# EAGLE design PCB-ETHMG-BOS2_v05-16 (EAGLE 7.5.0)
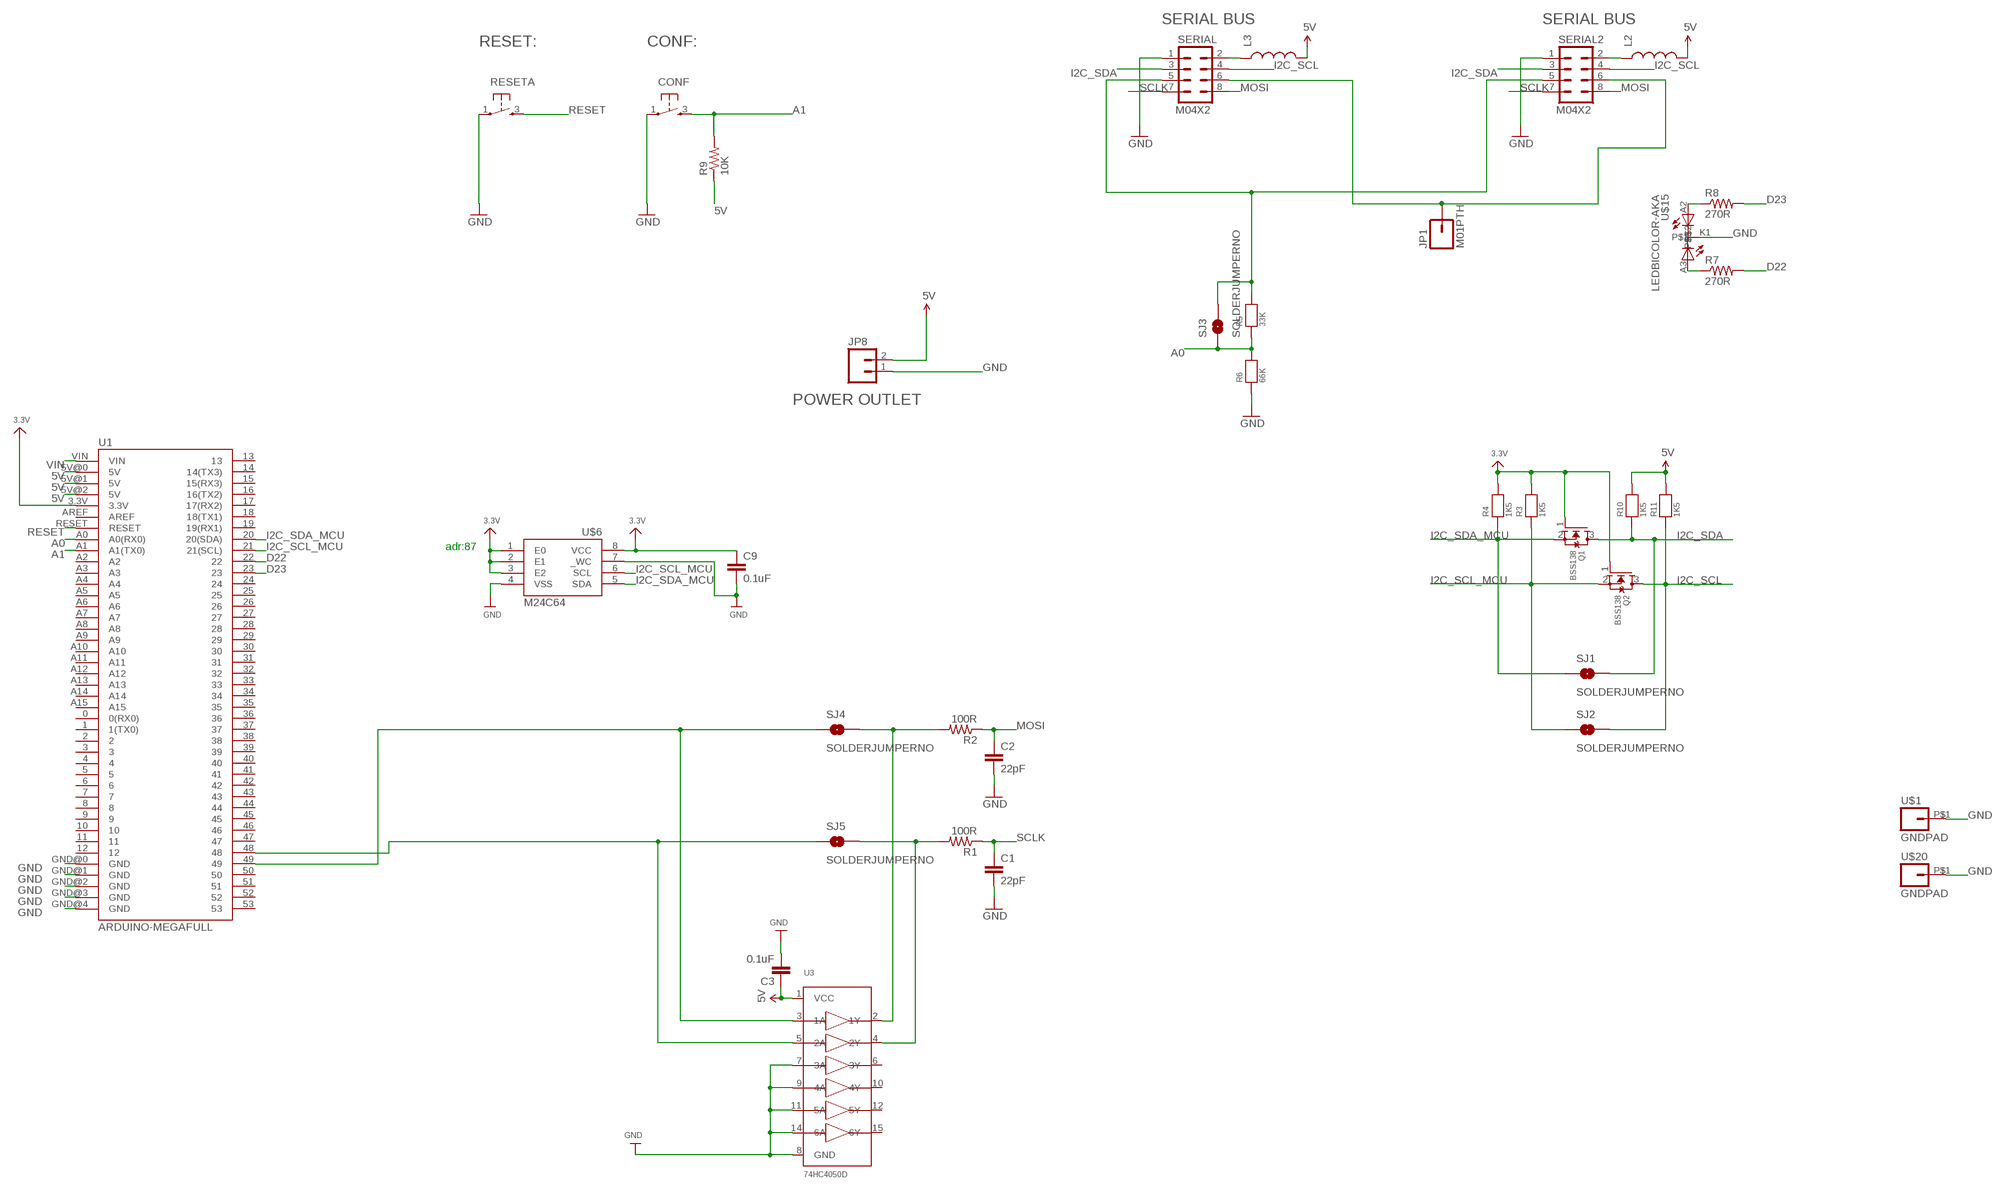
[diagram p0: schematic, sheet 1]

## Parts
C1  22pF  CAP0603-CAP  [0603-CAP]
C2  22pF  CAP0603-CAP  [0603-CAP]
C3  0.1uF  CAP0603-CAP  [0603-CAP]
C9  0.1uF  CAP0603-CAP  [0603-CAP]
CONF  TAC_SWITCH  [PUSHBUTTON]
JP1  M01PTH  [1X01]
JP8  M02PTH4  [1X02_XTRA_BIG]
L2  INDUCTOR0805  [0805]
L3  INDUCTOR0805  [0805]
Q1  BSS138  MOSFET-NREFLOW  [SOT23-R]
Q2  BSS138  MOSFET-NREFLOW  [SOT23-R]
R1  100R  RESISTOR0603-RES  [0603-RES]
R2  100R  RESISTOR0603-RES  [0603-RES]
R3  1K5  RESISTOR0603  [0603]
R4  1K5  RESISTOR0603  [0603]
R5  33K  RESISTOR0603  [0603]
R6  66K  RESISTOR0603  [0603]
R7  270R  RESISTOR0603-RES  [0603-RES]
R8  270R  RESISTOR0603-RES  [0603-RES]
R9  10K  RESISTOR0603-RES  [0603-RES]
R10  1K5  RESISTOR0603  [0603]
R11  1K5  RESISTOR0603  [0603]
RESETA  TAC_SWITCH  [PUSHBUTTON]
SERIAL  M04X2  [2X4]
SERIAL2  M04X2  [2X4]
SJ1  SOLDERJUMPERNO  [SJ_2S-NO]
SJ2  SOLDERJUMPERNO  [SJ_2S-NO]
SJ3  SOLDERJUMPERNO  [SJ_2S-NO]
SJ4  SOLDERJUMPERNO  [SJ_2S-NO]
SJ5  SOLDERJUMPERNO  [SJ_2S-NO]
U1  ARDUINO-MEGAFULL  [ARDUINO_MEGA]
U3  74HC4050D  74HC4050DTSSOP16  [TSSOP16]
U$1  GNDPAD  [3.2MMPAD]
U$6  M24C64  [TSSOP8]
U$15  LEDBICOLOR-AKA  [LED5MM-BICOLOR]
U$20  GNDPAD  [3.2MMPAD]

## Nets
3.3V [Power]: C9.1 Q1.1(G) Q2.1(G) R3.2 R4.2 U1.3.3V U$6.1(E0) U$6.2(E1) U$6.3(E2) U$6.8(VCC)
5V [Power]: C3.1 JP8.2 L2.2 L3.2 R9.1 R10.2 R11.2 U1.5V@0(5V) U1.5V@1(5V) U1.5V@2(5V) U3.1(VCC)
A0: R5.1 R6.2 SJ3.1 U1.A0(A0(RX0))
A1: CONF.3 R9.2 U1.A1(A1(TX0))
D22: R7.2 U1.22
D23: R8.2 U1.23
GND [Power]: C1.2 C2.2 C3.2 C9.2 CONF.1 JP8.1 R6.1 RESETA.1 SERIAL2.1 SERIAL.1 U1.GND@0(GND) U1.GND@1(GND) U1.GND@2(GND) U1.GND@3(GND) U1.GND@4(GND) U3.7(3A) U3.8(GND) U3.9(4A) U3.11(5A) U3.14(6A) U$1.P$1 U$6.4(VSS) U$6.7(_WC) U$15.K1 U$20.P$1
I2C_SCL: Q2.3(D) R11.1 SERIAL2.4 SERIAL.4 SJ2.2
I2C_SCL_MCU: Q2.2(S) R3.1 SJ2.1 U1.21(21(SCL)) U$6.6(SCL)
I2C_SDA: Q1.3(D) R10.1 SERIAL2.3 SERIAL.3 SJ1.2
I2C_SDA_MCU: Q1.2(S) R4.1 SJ1.1 U1.20(20(SDA)) U$6.5(SDA)
MOSI: C2.1 R2.1 SERIAL2.8 SERIAL.8
N$1 [Power]: L2.1 SERIAL2.2
N$2 [Power]: L3.1 SERIAL.2
N$3: R5.2 SERIAL2.5 SERIAL.5 SJ3.2
N$4: R2.2 SJ4.2 U3.2(1Y)
N$5: JP1.1 SERIAL2.6 SERIAL.6
N$6: R1.2 SJ5.2 U3.4(2Y)
N$14: SJ4.1 U1.49 U3.3(1A)
N$15: R8.1 U$15.A2
N$16: R7.1 U$15.A3
RESET: RESETA.3 U1.RESET
SCLK: C1.1 R1.1 SERIAL2.7 SERIAL.7
SCLK_3.3V: SJ5.1 U1.48 U3.5(2A)
VIN [Power]: U1.VIN
Unconnected: U1.0(0(RX0)) U1.1(1(TX0)) U1.2 U1.3 U1.4 U1.5 U1.6 U1.7 U1.8 U1.9 U1.10 U1.11 U1.12 U1.13 U1.14(14(TX3)) U1.15(15(RX3)) U1.16(16(TX2)) U1.17(17(RX2)) U1.18(18(TX1)) U1.19(19(RX1)) U1.24 U1.25 U1.26 U1.27 U1.28 U1.29 U1.30 U1.31 U1.32 U1.33 U1.34 U1.35 U1.36 U1.37 U1.38 U1.39 U1.40 U1.41 U1.42 U1.43 U1.44 U1.45 U1.46 U1.47 U1.50 U1.51 U1.52 U1.53 U1.A2 U1.A3 U1.A4 U1.A5 U1.A6 U1.A7 U1.A8 U1.A9 U1.A10 U1.A11 U1.A12 U1.A13 U1.A14 U1.A15 U1.AREF U3.6(3Y) U3.10(4Y) U3.12(5Y) U3.15(6Y)

## Notes on the sheet
- SERIAL BUS | SERIAL BUS
- RESET: | CONF:
- POWER OUTLET
- adr:87

## Library data of the parts
C1-C3 C9 = SparkFun:CAP: Capacitor Standard 0603 ceramic capacitor, and 0.1" leaded capacitor.
CONF RESETA = SKAARHOJ:TAC_SWITCH: Momentary Switch Button commonly used for reset or general input. Spark Fun Electronics SKU : COM-00097
JP1 = SparkFun:M01: Header 1 Standard 1-pin 0.1" header. Use with straight break away headers (SKU : PRT-00116), right angle break away headers (PRT-00553), swiss pins (PRT-00743), machine pins (PRT-00117), and female headers (PRT-00115).
JP8 = SparkFun:M02: Header 2 Standard 2-pin 0.1" header. Use with straight break away headers (SKU : PRT-00116), right angle break away headers (PRT-00553), swiss pins (PRT-00743), machine pins (PRT-00117), and female headers (PRT-00115). Molex polarized connector foot print use with SKU : PRT-08233 with associated crimp pins and housings.
L2 L3 = SparkFun:INDUCTOR: Inductors Basic Inductor/Choke - 0603 and 1206. Footprints are not proven and vary greatly between part numbers.
Q1 Q2 = microbuilder:MOSFET-N: N-Channel Mosfet LEGEND VDS: Voltage Drain-Source ID: Drain Current RDS(ON): Drain-Source On-State Resistance VGS(TH): Gate-Source Threshold Voltage CISS: Drain-Source Input Capacitance SOT-23 Name VDS ID RDS(ON) VGS(TH) CISS Order Number 2N7002E 60V 260mA 2.5 Ohm 2.5V @ 250uA 26.7pF @ 25V 2N7002ET1GOSTR-ND BSH103 30V 850mA 400 mOhm 400mV @ 1mA 83pF @ 24V BSH103,235-ND BSS138 60V 320mA 1.6 Ohm 1.5V @ 250uA 50pF @ 10V Mouser: 771-BSS138PW115 DMN2075U-7 20V 4.2A 38 mOhm 1V @ 250 uA 594.3pF @ 10V DMN2075U-7DICT-ND * BSS138 good choice for I2C level-shifting
R1 R2 R7-R9 = SparkFun:RESISTOR: Resistor Basic schematic elements and footprints for 0603, 1206, and PTH resistors.
R3-R6 R10 R11 = microbuilder:RESISTOR: Resistors 0402 - 0402 Surface Mount Package 22 Ohm 1% 1/16W [Digikey: 311-22.0LRTR-ND] 33 Ohm 5% 1/16W 1.0K 5% 1/16W 1.5K 5% 1/16W 2.0K 1% 1/16W 10.0K 1% 1/16W [Digikey: 311-10.0KLRTR-ND] 10.0K 5% 1/16W [Digikey: RMCF0402JT10K0TR-ND] 12.1K 1% 1/16W [Digikey: 311-22.0LRTR-ND] 100.0K 5% 1/16W 0603 - 0603 Surface Mount Package 0 Ohm 1/10 Watt 1% Resistor 15 Ohm 1/10 Watt 1% Resistor 33 Ohm 1/10 Watt 1% Resistor 49.9 Ohm 1/10 Watt 1% Resistor 100 Ohm 1/10 Watt 1% Resistor 150 Ohm 1/10 Watt 1% Resistor 240 Ohm 1/10 Watt 1% Resistor 390 Ohm 1/10 Watt 1% Resistor 560 Ohm 1/10 Watt 1% Resistor 680 Ohm 1/10 Watt 1% Resistor 750 Ohm 1/10 Watt 1% Resistor 1.0K Ohm 1/10 Watt 1% Resistor 1.5K Ohm 1/10 Watt 1% Resistor 2.0K Ohm 1/10 Watt 1% Resistor 2.2K Ohm 1/10 Watt 1% Resistor 3.3K Ohm 1/10 Watt 1% Resistor 4.7K Ohm 1/10 Watt 1% Resistor 10.0K Ohm 1/10 Watt 1% Resistor 12.0K Ohm 1/10 Watt 1% Resistor 12.1K Ohm 1/10 Watt 1% Resistor 20.0K Ohm 1/10 Watt 1% Resistor 33.0K Ohm 1/10 Watt 1% Resistor 100.0K Ohm 1/10 Watt 1% Resistor 0805 - 0805 Surface Mount Package 0 Ohm 1/8 Watt 1% Resistor 33 Ohm 1/8 Watt 1% Resistor 100 Ohm 1/8 Watt 1% Resistor 150 Ohm 1/8 Watt 1% Resistor 200 Ohm 1/8 Watt 1% Resistor 240 Ohm 1/8 Watt 1% Resistor 330 Ohm 1/8 Watt 1% Resistor 390 Ohm 1/8 Watt 1% Resistor 470 Ohm 1/8 Watt 1% Resistor 1.0K Ohm 1/8 Watt 1% Resistor 1.5K Ohm 1/8 Watt 1% Resistor 2.0K Ohm 1/8 Watt 1% Resistor 4.7K Ohm 1/8 Watt 1% Resistor 5.1K Ohm 1/8 Watt 1% Resistor 5.6K Ohm 1/8 Watt 1% Resistor 10.0K Ohm 1/8 Watt 1% Resistor 22.0K Ohm 1/8 Watt 1% Resistor 33.0K Ohm 1/8 Watt 1% Resistor 100K Ohm 1/8 Watt 1% Resistor 1206 - 1206 Surface Mount Package 2012 - 2010 Surface Mount Package 0.11 Ohm 1/2 Watt 1% Resistor - Digikey: RHM.11UCT-ND
SERIAL SERIAL2 = SparkFun:M04X2
SJ1-SJ5 = SparkFun:SOLDERJUMPER: Solder Jumper Standard SMD solder jumper. Used to automate production. Two varients : Normally Open and Normally Closed are the same, but have different paste layers. NC will have a large amount of paste and should jumper during reflow.
U1 = SKAARHOJ:ARDUINO-MEGA: Arduino Mega footprint connections
U3 = SKAARHOJ:74HC4050D: 6-channel level shifter 74HC4050D - 2V-6V Supply Digikey: 74HC4050D,653-ND Mouser: 771-74HC4050D-T
U$1 U$20 = SKAARHOJ:GNDPAD
U$6 = SKAARHOJ:M24C64
U$15 = SKAARHOJ:LEDBICOLOR-AKA

## Net classes
0 default: width 0.203 mm, drill 0.61 mm, clearance 0.203 mm
1 Power: width 0.406 mm, drill 0.61 mm, clearance 0.203 mm
2 RELAY LINES: width 0.305 mm, clearance 0.203 mm
3 INput lines: clearance 0.203 mm

## Board
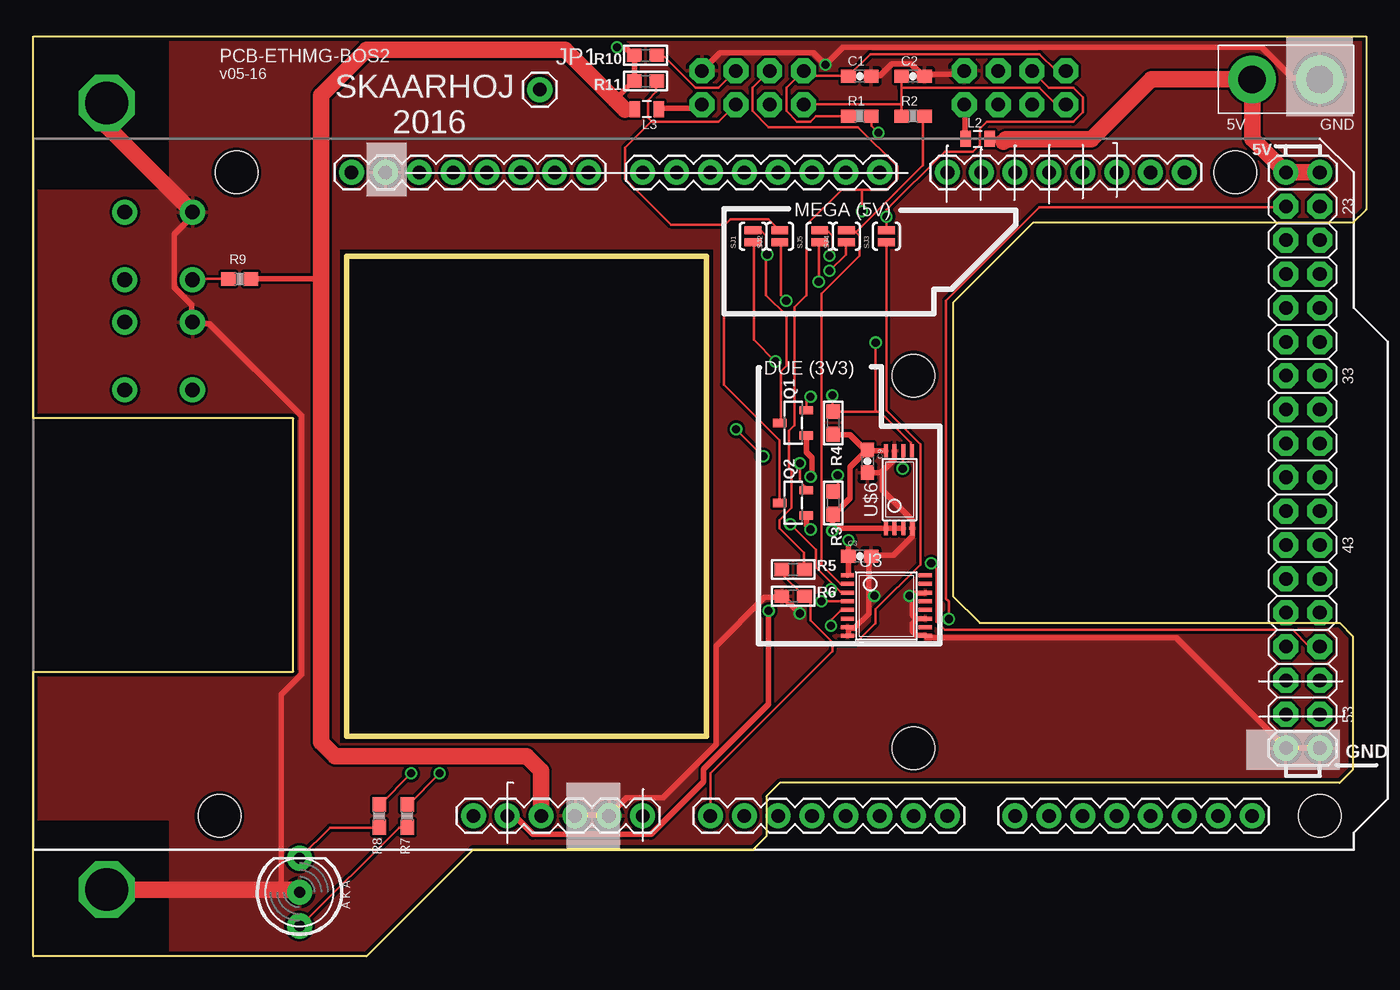
[diagram p1: board, top side]
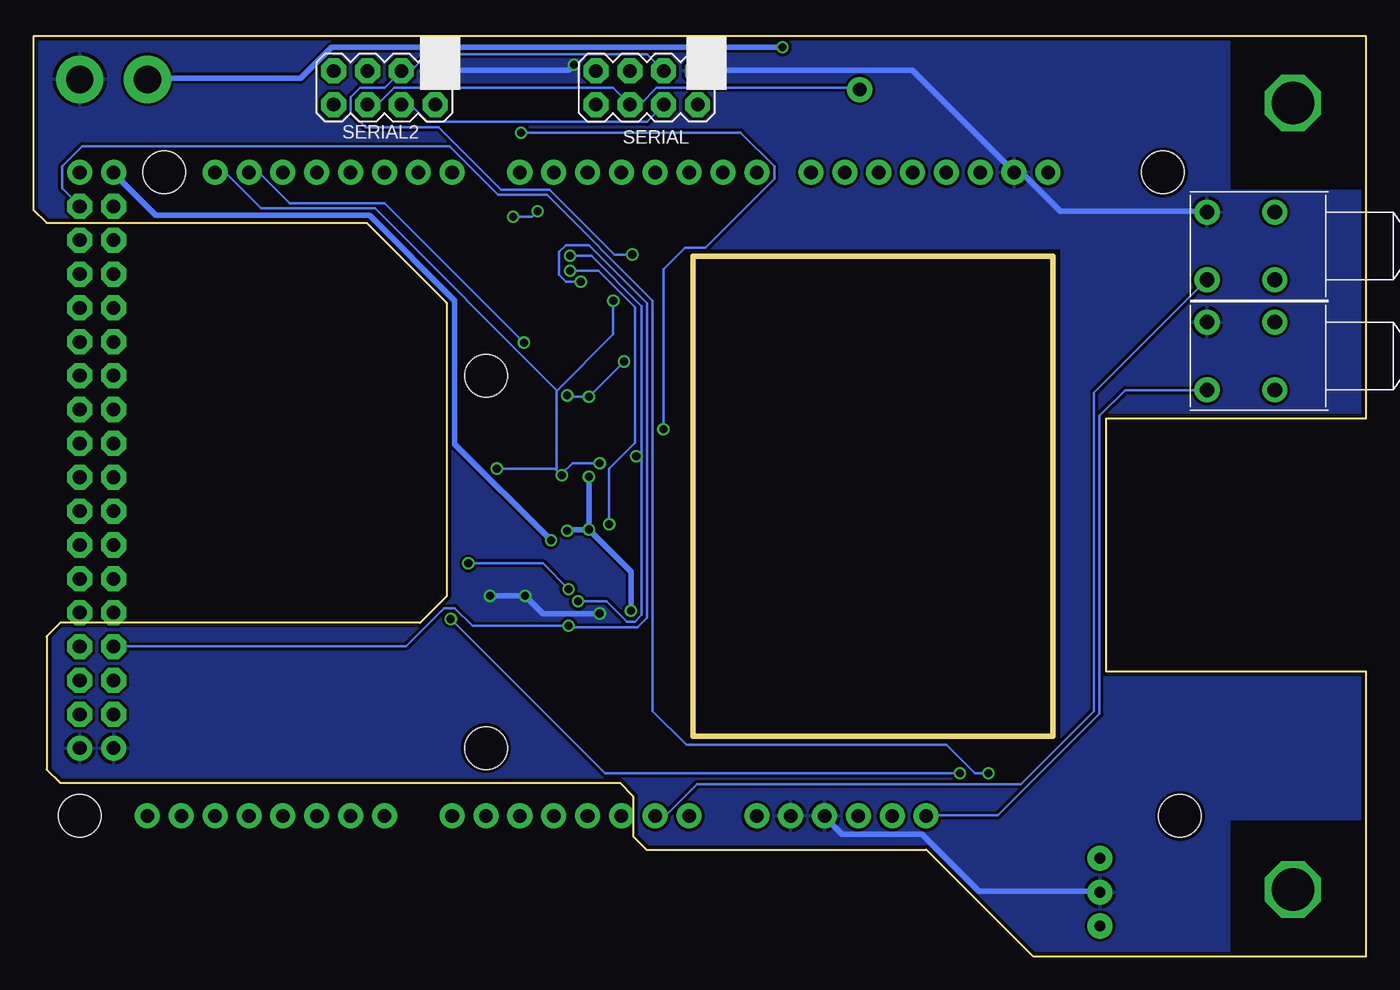
[diagram p2: board, bottom side, seen from below]

Size 100 x 69 mm. Coordinates in mm from the lower left corner, seen from the top.
Outline: 0,0 0,21.34 19.5,21.34 19.5,40.34 0,40.34 0,69 100,69 100,56 99,55 75,55 69,49 69,27 71,25 98,25 99,24 99,14 98,13 56,13 55,12 55,9 54,8 33,8 25,0 0,0
Copper layers (1*16): Top 0.035mm / dielectric 1.5mm / Bottom 0.035mm
Design rules "Fusion_eagle_rule_v1.1": minimum track width 6mil, minimum drill 12mil, track to track 6mil, track to pad 6mil, pad to pad 6mil, via to via 6mil, smd to smd 0mil, copper to edge 10mil, drill to drill 10mil, minimum pad ring 10mil, minimum via ring 6mil, stop-mask expansion 2mil, vias tented up to drill 100mil, thermal gap 10mil
tRestrict: area 0,0 to 10.2,10.2; area 0,57.5 to 10.2,68.9; area 23,16 to 51,53
bRestrict: area 0,57.5 to 10.2,68.9; area 0,0 to 10.2,10.2; area 23,16 to 51,53
Milling: 4 lines

### Footprints (pad centres in the part's own frame; a part is rotated, then mirrored left to right if it is on the bottom)
0603-CAP = smd 1.1 x 1: 1 -0.85,0; 2 0.85,0
PUSHBUTTON = drill 1.1 pad 1.88: 1 2.54,2.54; 2 2.54,-2.54; 3 -2.54,2.54; 4 -2.54,-2.54
1X01 = drill 1.016 pad 1.88: 1 0,0
1X02_XTRA_BIG = drill 2.057 pad 3.556: 1 -2.54,0; 2 2.54,0
0805 = smd 0.8 x 1.2: 1 -0.9,0; 2 0.9,0
SOT23-R = smd 0.635 x 1.016: 1 -0.95,-1; 2 0.95,-1; 3 0,1
0603-RES = smd 1.1 x 1: 1 -0.85,0; 2 0.85,0
0603 = smd 1.1 x 1: 1 -0.85,0; 2 0.85,0
2X4 = drill 1.016 pad 1.88 octagon: 1 -3.81,-1.27; 2 -3.81,1.27; 3 -1.27,-1.27; 4 -1.27,1.27; 5 1.27,-1.27; 6 1.27,1.27; 7 3.81,-1.27; 8 3.81,1.27
SJ_2S-NO = smd 0.635 x 1.27: 1 -0.45,0; 2 0.45,0
ARDUINO_MEGA = drill 1.016 pad 1.88: 0 63.5,50.8; 1 60.96,50.8; 2 58.42,50.8; 3 55.88,50.8; 3.3V 35.56,2.54; 4 53.34,50.8; 5 50.8,50.8; 5V@0 38.1,2.54; 5V@1 93.98,50.8; 5V@2 96.52,50.8; 6 48.26,50.8; 7 45.72,50.8; 8 41.656,50.8; 9 39.116,50.8; 10 36.576,50.8; 11 34.036,50.8; 12 31.496,50.8; 13 28.956,50.8; 14 68.58,50.8; 15 71.12,50.8; 16 73.66,50.8; 17 76.2,50.8; 18 78.74,50.8; 19 81.28,50.8; 20 83.82,50.8; 21 86.36,50.8; A0 50.8,2.54; A1 53.34,2.54; A2 55.88,2.54; A3 58.42,2.54; A4 60.96,2.54; A5 63.5,2.54; A6 66.04,2.54; A7 68.58,2.54; A8 73.66,2.54; A9 76.2,2.54; A10 78.74,2.54; A11 81.28,2.54; A12 83.82,2.54; A13 86.36,2.54; A14 88.9,2.54; A15 91.44,2.54; AREF 23.876,50.8; GND@0 40.64,2.54; GND@1 43.18,2.54; GND@2 93.98,7.62; GND@3 96.52,7.62; GND@4 26.416,50.8; RESET 33.02,2.54; VIN 45.72,2.54 | drill 1.016 pad 1.88 octagon: 22 93.98,48.26; 23 96.52,48.26; 24 93.98,45.72; 25 96.52,45.72; 26 93.98,43.18; 27 96.52,43.18; 28 93.98,40.64; 29 96.52,40.64; 30 93.98,38.1; 31 96.52,38.1; 32 93.98,35.56; 33 96.52,35.56; 34 93.98,33.02; 35 96.52,33.02; 36 93.98,30.48; 37 96.52,30.48; 38 93.98,27.94; 39 96.52,27.94; 40 93.98,25.4; 41 96.52,25.4; 42 93.98,22.86; 43 96.52,22.86; 44 93.98,20.32; 45 96.52,20.32; 46 93.98,17.78; 47 96.52,17.78; 48 93.98,15.24; 49 96.52,15.24; 50 93.98,12.7; 51 96.52,12.7; 52 93.98,10.16; 53 96.52,10.16 | hole 3.2: 15.24,50.8; 13.97,2.54; 66.04,35.56; 66.04,7.62; 90.17,50.8; 96.52,2.54
TSSOP16 = smd 0.305 x 0.991: 1 -3.575,-2.918; 2 -2.925,-2.918; 3 -2.275,-2.918; 4 -1.625,-2.918; 5 -0.975,-2.918; 6 -0.325,-2.918; 7 0.325,-2.918; 8 0.975,-2.918; 9 0.975,2.918; 10 0.325,2.918; 11 -0.325,2.918; 12 -0.975,2.918; 13 -1.625,2.918; 14 -2.275,2.918; 15 -2.925,2.918; 16 -3.575,2.918
3.2MMPAD = drill 3.2 octagon: P$1 0,0
TSSOP8 = smd 0.305 x 0.991: 1 -1.035,-2.918; 2 -0.385,-2.918; 3 0.265,-2.918; 4 0.915,-2.918; 5 0.915,2.918; 6 0.265,2.918; 7 -0.385,2.918; 8 -1.035,2.918
LED5MM-BICOLOR = drill 0.813 pad 1.88: A2 2.54,0; A3 -2.54,0; K1 0,0

### Placement (x,y rotation side)
C1  62,66 0 top
C2  66,66 0 top
C3  62,30 0 top
C9  62.59,37.12 270 top
CONF  9.4,53.27 90 bottom
JP1  38,65 0 top
JP8  93.98,65.77 180 top
L2  70.84,61.3 0 top
L3  46.03,63.54 180 top
Q1  57,40 90 top
Q2  57,34 90 top
R1  62,63 0 top
R2  66,63 0 top
R3  60,34 270 top
R4  60,40 270 top
R5  57,29 0 top
R6  57,27 0 top
R7  28.05,10.53 90 top
R8  25.95,10.53 90 top
R9  15.48,50.8 180 top
R10  45.94,67.57 180 top
R11  45.94,65.64 180 top
RESETA  9.4,45.02 90 bottom
SERIAL  53.98,65.14 180 bottom
SERIAL2  73.66,65.14 180 bottom
SJ1  54,54 90 top
SJ2  56,54 90 top
SJ3  64,54 90 top
SJ4  61,54 90 top
SJ5  59,54 90 top
U1  0,7.99 0 top
U3  64,25 270 top
U$1  5.5,64 0 top
U$6  65,35 0 top
U$15  19.97,4.81 90 top
U$20  5.5,5 0 top

### Tracks (layer width: path | path; a pad name or v marks a point on that pad's centre or on a via)
3.3V  (via drill 0.61)
  Top 0.406: U$6.8 63.91,37.9 62.69,37.9 C9.1 | R4.2 60.05,39.12 61.27,39.12 62.38,38 C9.1 | U$6.3 65.23,32.11 64.82,32.11 U$6.2 64.52,32.11 64.01,32.11 U$6.1 63.8,32.11 60.05,32.11 v59.94,31.9 59.94,33.12 R3.2 60.15,33.22 61.27,34.34 61.27,36.68 62.38,37.8 C9.1 | v58.32,32 58.01,32.31 58.01,33.02 Q2.1 | v58.32,35.97 58.42,36.07 58.42,37.39 58.01,37.8 58.01,39.01 Q1.1 | v55.17,25.91 55.17,18.9 50.29,14.02 50.29,13.11 46.33,9.14 37.49,9.14 36.17,10.46 35.56,10.46 U1.3.3V
  Bottom 0.406: v58.32,32 59.84,32 v59.94,31.9 | v58.32,32 v58.32,35.97 | v55.17,25.91 55.17,28.85 v58.32,32
5V  (via drill 0.61)
  Top 0.406: U3.1 61.16,28.65 61.16,29.97 C3.1 61.16,30.18 v61.16,31.19 | L2.2 71.83,61.27 72.24,61.27 72.77,61.09 | 21.59,50.8 R9.1 | 43.63,64.26 45.01,65.63 R11.2 45.11,65.84 45.11,67.56 R10.2 44.91,67.67 44.4,68.17 v43.79,68.17 | L3.2 45.11,63.5 44.39,63.5
  Top 1.219: U1.5V@2 U1.5V@1 91.44,61.33 JP8.2 83.87,65.77 79.38,61.28 72.96,61.28 72.77,61.09 | U1.5V@0 38.1,13.9 37,15 22.66,15 21.59,16.07 21.59,50.8 21.59,64.59 25,68 39.89,68 43.63,64.26 44.39,63.5
  Bottom 0.406: v43.79,68.17 77.62,68.17 79.96,65.84 91.44,65.84 JP8.2 | v61.16,31.19 68.38,38.41 68.38,49.17 74.78,55.58 90.83,55.58 93.98,58.73 U1.5V@1
A0
  Top 0.203: R5.1 56.19,28.96 56.19,28.65 57.81,27.03 R6.2 57.91,26.92 58.32,26.52 58.32,25.2 59.99,23.52 | 59.99,23.52 60.05,23.47 61.67,23.47 63.2,24.99 63.2,26.01 66.55,29.36 66.55,38.41 64.01,40.95 SJ3.1 | U1.A0 50.8,13.72 59.94,22.86 59.94,23.47 59.99,23.52
A1
  Top 0.203: R9.2 11.99,50.8 CONF.3
  Bottom 0.203: U1.A1 53.34,10.57 52.53,10.57 50.19,12.9 25.91,12.9 20.42,18.39 20.42,42.27 11.99,50.7 CONF.3
D22  (via drill 0.61)
  Top 0.203: v30.48,13.72 28.14,11.38 R7.2 | v68.68,25.3 68.68,26.62 68.48,26.82 68.48,49.17 75.49,56.19 93.98,56.19 U1.22
  Bottom 0.203: v30.48,13.72 57.1,13.72 v68.68,25.3
D23  (via drill 0.61)
  Top 0.203: v28.35,13.72 26.01,11.38 R8.2
  Bottom 0.203: v28.35,13.72 29.36,13.72 31.5,15.85 51,15.85 53.54,18.39 53.54,49.17 61.47,57.1 65.13,57.1 68.78,60.76 96.32,60.76 97.84,59.23 97.84,57.61 96.52,56.29 U1.23
GND  (via drill 0.61)
  Top 0.406: U1.GND@0 40.64,10.57 43.08,10.57 U1.GND@1 43.18,10.57 44.5,11.89 47.24,11.89 51.21,15.85 51.21,23.27 54.86,26.92 56.08,26.92 R6.1 56.29,26.92 v57.51,25.7 | 63.6,36.27 64.62,37.29 64.62,37.9 U$6.7 | 63.6,36.27 62.69,36.27 C9.2 | U3.8 61.16,24.08 61.16,24.59 U3.7 61.37,24.59 61.57,24.59 62.69,25.7 62.69,27.03 | 62.69,27.03 62.69,29.87 C3.2 62.89,30.07 64.52,30.07 65.94,31.5 65.94,32 U$6.4 65.94,32.21 65.94,32.72 63.7,34.95 63.7,36.17 63.6,36.27 | 66.24,25.3 65.94,24.99 65.94,24.38 66.24,24.08 66.85,24.08 U3.9 67.06,23.88 85.75,23.88 93.98,15.65 U1.GND@2 94.08,15.65 96.52,15.65 U1.GND@3 | 66.24,25.3 66.85,25.3 U3.11 | 65.94,26.92 66.24,27.23 66.85,27.23 U3.14 | 65.94,26.92 65.94,25.6 66.24,25.3 | v63.09,27.03 62.69,27.03 | v65.73,27.03 65.84,27.03 65.94,26.92 | C1.2 62.89,66.04 63.5,66.04 64.41,66.95 65.84,66.95 66.75,66.04 C2.2 66.95,66.14 69.6,66.14 69.8,66.34 SERIAL2.1 | CONF.1 11.68,55.27 10.57,54.15 10.57,50.19 11.89,48.87 11.89,47.65 RESETA.1 12.09,47.45 13.21,47.45 20.12,40.54 20.12,21.13 18.59,19.61 18.59,5 | SERIAL.1 50.19,66.45 51.51,67.77 58.52,67.77 v59.44,66.85 60.76,68.17 92.15,68.17 94.49,65.84 96.52,65.84 JP8.1
  Top 1.219: U$1.P$1 5.5,62.25 CONF.1 | U$20.P$1 18.59,5 19.78,5 U$15.K1
  Bottom 0.406: U$15.K1 20.02,4.88 29.06,4.88 33.33,9.14 39.32,9.14 40.64,10.46 U1.GND@0 | v65.73,27.03 v63.09,27.03 61.77,25.7 v57.51,25.7 | CONF.1 11.99,55.88 22.96,55.88 25.81,58.73 26.42,58.73 U1.GND@4 26.52,58.93 34.04,66.45 50.09,66.45 SERIAL.1 | v59.44,66.85 59.84,66.45 69.8,66.45 SERIAL2.1
  pour Bottom: 0,0 100,0 100,69 0,69
  pour Top: 0,0 100,0 100,69 0,69
I2C_SCL
  Top 0.203: 51.87,54.81 52.32,55.27 55.17,55.27 55.98,54.46 SJ2.2 | 51.87,54.81 51.82,54.76 51.82,42.88 55.98,38.71 55.98,34.04 Q2.3 | 46.38,62.64 46.43,62.59 51.41,62.59 52.63,63.8 SERIAL.4 | 46.38,62.64 46.13,62.89 46.13,64.21 46.74,64.82 46.74,65.63 R11.1 | 46.38,62.64 44.4,60.66 44.4,58.32 47.85,54.86 51.82,54.86 51.87,54.81
  Bottom 0.203: SERIAL2.4 72.34,63.8 71.63,63.8 70.41,62.59 53.95,62.59 52.73,63.8 SERIAL.4
I2C_SCL_MCU  (via drill 0.61)
  Top 0.203: v65.23,36.58 65.23,37.9 U$6.6 | v60.35,36.07 60.35,35.26 60.05,34.95 R3.1 | v57.51,36.98 57.51,35.66 57.91,35.26 57.91,34.95 Q2.2 | v56.49,49.17 56.08,49.58 56.08,53.54 SJ2.1
  Bottom 0.203: v65.23,36.58 60.86,36.58 60.81,36.52 | 60.81,36.52 v60.35,36.07 60.35,36.17 59.54,36.98 v57.51,36.98 | v56.49,49.17 56.49,46.63 60.71,42.42 | 60.71,42.42 60.76,42.37 60.76,36.58 60.81,36.52 | 60.71,42.42 74.37,56.08 82.91,56.08 85.55,58.73 86.36,58.73 U1.21
I2C_SDA  (via drill 0.61)
  Top 0.203: 54.97,52.63 54.97,54.05 54.66,54.36 54.05,54.36 SJ1.2 | 54.97,52.63 54.97,49.58 56.49,48.06 56.49,44.3 56.08,43.89 56.08,40.03 Q1.3 | R10.1 46.84,67.56 47.24,67.56 49.68,65.13 51.41,65.13 52.63,66.34 SERIAL.3 | v55.07,52.63 54.97,52.63
  Bottom 0.203: SERIAL.3 52.73,66.45 53.95,67.67 70.41,67.67 71.63,66.45 72.34,66.45 SERIAL2.3 72.44,66.34 73.66,65.13 75.49,65.13 76.2,64.41 76.2,63.3 75.08,62.18 69.6,62.18 64.92,57.51 61.27,57.51 56.39,52.63 v55.07,52.63
I2C_SDA_MCU  (via drill 0.61)
  Top 0.203: 63.2,40.84 60.05,40.84 R4.1 59.94,40.95 v59.94,42.06 | 63.2,40.84 63.5,40.84 65.84,38.51 65.84,38 U$6.5 | v58.32,41.96 58.01,41.66 58.01,41.05 Q1.2 | v55.68,44.6 54.05,46.23 54.05,53.54 SJ1.1 | 63.2,40.84 v63.2,46.02
  Bottom 0.203: v59.94,42.06 59.84,41.96 v58.32,41.96 v55.68,44.6 | v63.2,46.02 73.66,56.49 80.77,56.49 83.01,58.73 83.82,58.73 U1.20
MOSI
  Top 0.203: 65.13,65.13 65.13,65.94 C2.1 | 65.13,65.13 65.13,63.91 | 65.13,63.91 65.13,63.09 R2.1 | 65.13,63.91 57.81,63.91 SERIAL.8 | 65.13,65.13 75.49,65.13 76.71,63.91 77.42,63.91 SERIAL2.8
N$1
  Top 0.406: L2.1 69.9,61.37 69.9,63.8 SERIAL2.2
N$2
  Top 0.406: L3.1 46.94,63.6 49.89,63.6 50.09,63.8 SERIAL.2
N$3  (via drill 0.61)
  Top 0.203: SJ3.2 v64.01,55.47 64.01,55.98 68.38,60.35 70.51,60.35 71.02,60.86 71.02,62.08 71.53,62.59 78.03,62.59 78.74,63.3 78.74,64.41 78.03,65.13 76.2,65.13 74.98,66.34 SERIAL2.5 | 62.18,57.51 64.01,57.51 64.82,58.32 64.82,59.23 61.87,62.18 55.17,62.18 53.95,63.4 53.95,65.13 55.17,66.34 SERIAL.5 | 62.18,57.51 60.66,57.51 58.01,54.86 58.01,49.58 57.1,48.67 57.1,39.83 56.69,39.42 56.69,36.68 56.9,36.47 56.9,33.63 55.98,32.72 55.98,32.11 57.81,30.28 57.81,29.06 R5.2 | 62.18,57.51 v62.18,55.88
  Bottom 0.203: v64.01,55.47 62.59,55.47 v62.18,55.88
N$4
  Top 0.203: 61.72,54.3 61.67,54.36 61.06,54.36 SJ4.2 | 61.72,54.3 61.98,54.05 61.98,52.53 59.13,49.68 59.13,29.36 60.55,27.94 61.06,27.94 U3.2 | 61.72,54.3 66.75,59.33 66.75,62.99 R2.2
N$5
  Bottom 0.203: JP1.1 38.1,65.02 38.2,65.13 53.24,65.13 54.46,63.91 55.17,63.91 SERIAL.6 55.27,63.91 56.49,65.13 72.95,65.13 74.17,63.91 74.88,63.91 SERIAL2.6
N$6  (via drill 0.61)
  Top 0.203: v59.13,26.62 61.06,26.62 U3.4 | v59.74,52.53 59.74,52.83 59.94,53.03 59.94,54.05 59.64,54.36 59.03,54.36 SJ5.2 | v63.4,61.77 62.89,62.28 62.89,62.99 R1.2 | v54.76,37.49 v52.73,39.52
  Bottom 0.203: v59.13,26.62 57,26.62 55.47,25.09 54.86,25.09 54.36,25.6 54.36,37.49 | 54.36,37.49 54.36,48.77 58.12,52.53 v59.74,52.53 | v63.4,61.77 46.94,61.77 44.4,59.23 44.4,58.32 49.58,53.14 51.1,53.14 52.73,51.51 v52.73,39.52 | 54.36,37.49 v54.76,37.49
N$14  (via drill 0.61)
  Top 0.203: 60.1,27.79 58.73,29.16 58.73,30.48 v56.79,32.41 | 60.1,27.79 60.55,27.33 61.06,27.33 U3.3 | v59.74,51.41 60.96,52.63 60.96,53.54 SJ4.1 | v67.36,29.46 67.77,29.06 67.77,25.09 68.38,24.49 94.49,24.49 95.71,23.27 96.52,23.27 U1.49 | 60.1,27.79 v59.84,27.53
  Bottom 0.203: v56.79,32.41 56.79,36.58 54.86,38.51 54.86,48.67 57.61,51.41 v59.74,51.41 | v67.36,29.46 61.77,29.46 v59.84,27.53
N$15
  Top 0.203: R8.1 25.91,9.65 22.25,9.65 20.02,7.42 U$15.A2
N$16
  Top 0.203: R7.1 28.04,9.65 27.43,9.65 20.02,2.23 U$15.A3
RESET
  Bottom 0.203: RESETA.3 11.99,42.47 18.09,42.47 20.02,40.54 20.02,18.19 27.64,10.57 33.02,10.57 U1.RESET
SCLK
  Top 0.203: R1.1 61.06,62.99 58.73,62.99 58.32,62.59 57.3,62.59 56.49,63.4 56.49,65.13 57.71,66.34 SERIAL.7 57.81,66.34 58.12,66.04 61.06,66.04 C1.1 61.16,66.04 62.79,67.67 75.49,67.67 76.71,66.45 77.42,66.45 SERIAL2.7
SCLK_3.3V  (via drill 0.61)
  Top 0.203: v59.84,24.79 59.84,25.2 60.55,25.91 61.06,25.91 U3.5 | v58.93,50.6 58.93,53.54 SJ5.1
  Bottom 0.203: U1.48 93.98,23.27 72.03,23.27 69.19,26.11 68.38,26.11 67.06,24.79 v59.84,24.79 59.74,24.69 54.66,24.69 53.95,25.4 53.95,48.97 58.32,53.34 60.05,53.34 60.55,52.83 60.55,51.1 60.05,50.6 v58.93,50.6

### Text on the board
_tsilk: PCB-ETHMG-BOS2 | v05-16 | SKAARHOJ / 2016 | 5V | GND | 23 | MEGA (5V) | DUE (3V3) | 33 | 43 | 53